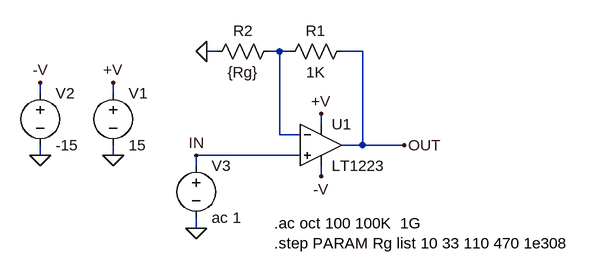
[diagram p0: schematic 1223.asc]
1223.asc, the LTspice schematic file:
Version 4
SHEET 1 896 680
WIRE -48 96 -64 96
WIRE 48 96 32 96
WIRE 64 96 48 96
WIRE 176 96 144 96
WIRE -320 160 -320 144
WIRE -208 160 -208 144
WIRE 112 208 112 192
WIRE 48 224 48 96
WIRE 80 224 48 224
WIRE 176 240 176 96
WIRE 176 240 144 240
WIRE 240 240 176 240
WIRE -320 256 -320 240
WIRE -208 256 -208 240
WIRE 80 256 -80 256
WIRE -80 272 -80 256
WIRE 112 288 112 272
WIRE -80 368 -80 352
FLAG -208 256 0
FLAG 112 192 +V
FLAG -208 144 +V
FLAG 112 288 -V
FLAG -320 256 0
FLAG -320 144 -V
FLAG -64 96 0
FLAG -80 368 0
FLAG 240 240 OUT
FLAG -80 256 IN
SYMBOL voltage -208 144 R0
SYMATTR InstName V1
SYMATTR Value 15
SYMBOL voltage -320 144 R0
SYMATTR InstName V2
SYMATTR Value -15
SYMBOL res 160 80 R90
WINDOW 0 0 56 VBottom 2
WINDOW 3 32 56 VTop 2
SYMATTR InstName R1
SYMATTR Value 1K
SYMBOL res 48 80 R90
WINDOW 0 0 56 VBottom 2
WINDOW 3 32 56 VTop 2
SYMATTR InstName R2
SYMATTR Value {Rg}
SYMBOL voltage -80 256 R0
SYMATTR InstName V3
SYMATTR Value ac 1
SYMBOL opamps\\LT1223 112 176 R0
SYMATTR InstName U1
TEXT 40 360 Left 2 !.ac oct 100 100K  1G\n.step PARAM Rg list 10 33 110 470 1e308

The netlist it stands for:
* 1223.asc
V1 +V 0 15
V2 -V 0 -15
R1 OUT N001 1K
R2 N001 0 {Rg}
V3 IN 0 ac 1
XU1 IN N001 +V -V OUT LT1223  ; pins In+ In- V+ V- OUT
.ac oct 100 100K  1G
.step PARAM Rg list 10 33 110 470 1e308
.backanno
.end